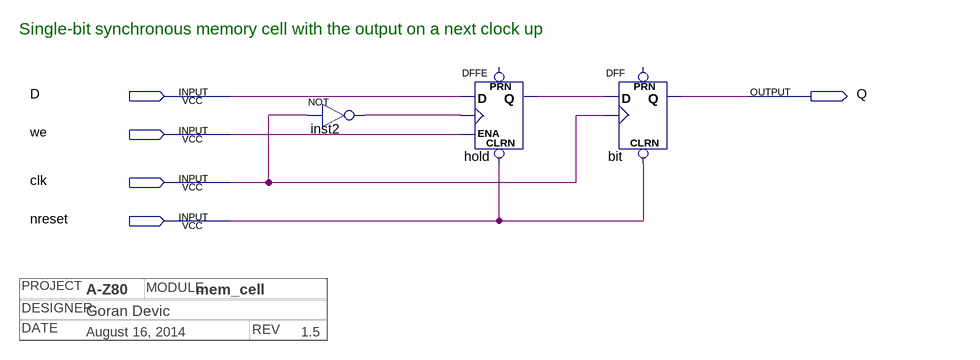
[diagram p0: schematic sheet]
// Quartus schematic mem_cell.bdf as structural Verilog: 3 symbols, 5 pins
// Title block: DATE: August 16, 2014; DESIGNER: Goran Devic; MODULE: mem_cell; PROJECT: A-Z80; REV: 1.5
module mem_cell (
  input  D,
  input  we,
  input  clk,
  input  nreset,
  output Q
);

  wire hold_q, inst2_out;

  not inst2 (inst2_out, clk);
  DFFE hold (.CLRN(nreset), .D(D), .CLK(inst2_out), .ENA(we), .Q(hold_q));  // open: PRN
  DFF \bit  (.CLRN(nreset), .CLK(clk), .D(hold_q), .Q(Q));  // open: PRN

  // Notes on the sheet:
  //   Single-bit synchronous memory cell with the output on a next clock up
endmodule
